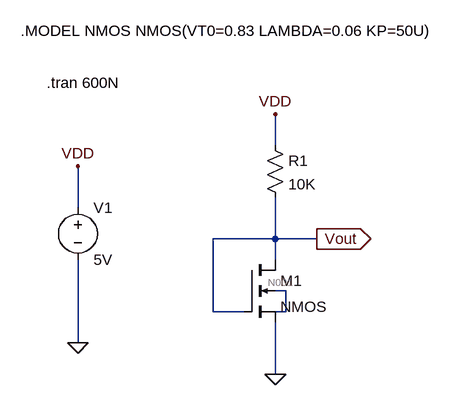
[diagram p0: schematic NMOS_Potential Divider.asc]
NMOS_Potential Divider.asc, the LTspice schematic file:
Version 4
SHEET 1 880 680
WIRE 128 -16 128 -64
WIRE -176 80 -176 16
WIRE 128 128 128 64
WIRE 128 128 32 128
WIRE 192 128 128 128
WIRE 128 160 128 128
WIRE 144 208 128 208
WIRE 32 240 32 128
WIRE 80 240 32 240
WIRE 144 240 144 208
WIRE 144 240 128 240
WIRE -176 288 -176 160
WIRE 128 336 128 256
FLAG -176 288 0
FLAG -176 16 VDD
FLAG 128 -64 VDD
FLAG 192 128 Vout
IOPIN 192 128 Out
FLAG 128 336 0
SYMBOL nmos4 80 160 R0
SYMATTR InstName M1
SYMATTR Value2 l=5 w=15
SYMBOL voltage -176 64 R0
WINDOW 123 0 0 Left 2
WINDOW 39 0 0 Left 2
SYMATTR InstName V1
SYMATTR Value 5V
SYMBOL res 112 -32 R0
SYMATTR InstName R1
SYMATTR Value 10K
TEXT -264 -192 Left 2 !.MODEL NMOS NMOS(VT0=0.83 LAMBDA=0.06 KP=50U)
TEXT -224 -112 Left 2 !.tran 600N

The netlist it stands for:
* NMOS_Potential Divider.asc
M1 Vout Vout 0 N001 NMOS l=5 w=15
V1 VDD 0 5V
R1 VDD Vout 10K
.model NMOS NMOS
.model PMOS PMOS
.lib standard.mos
.MODEL NMOS NMOS(VT0=0.83 LAMBDA=0.06 KP=50U)
.tran 600N
.backanno
.end

* Results of the author's LTspice run, read from the files saved beside the schematic
* Operating Point, zero values left out:
*   V(vout) = 2.523 V
*   V(n001) = 138.6 mV
*   V(vdd) = 5 V
*   Id(M1) = 247.7 µA
*   Is(M1) = -247.7 µA
*   I(R1) = 247.7 µA
*   I(V1) = -247.7 µA
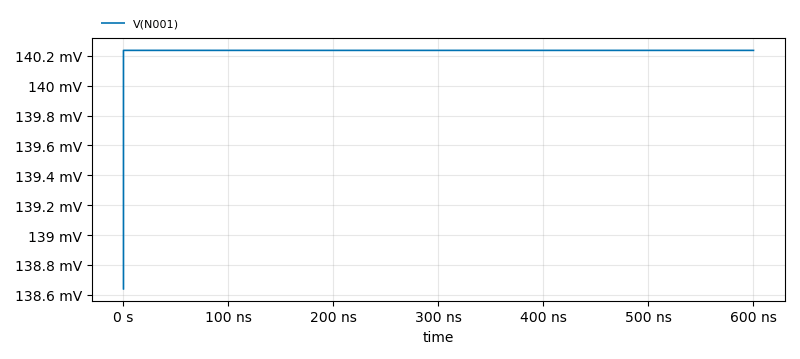
[diagram p1: Transient Analysis of NMOS_Potential Divider.asc, plotted from the saved traces]
* Transient Analysis, 1 run:
*   V(N001): min 138.6 mV, max 140.2 mV, average 140.2 mV, rms 140.2 mV, last 140.2 mV